# Altium schematic sheet Sheet2.SchDoc: solar-powered-remote-water-level-relay
size 419 x 297 mm; Date: 2026/06/29; Author: forlook88@gmail.com; Revision: 0; SheetNumber: 2; SheetTotal: 11
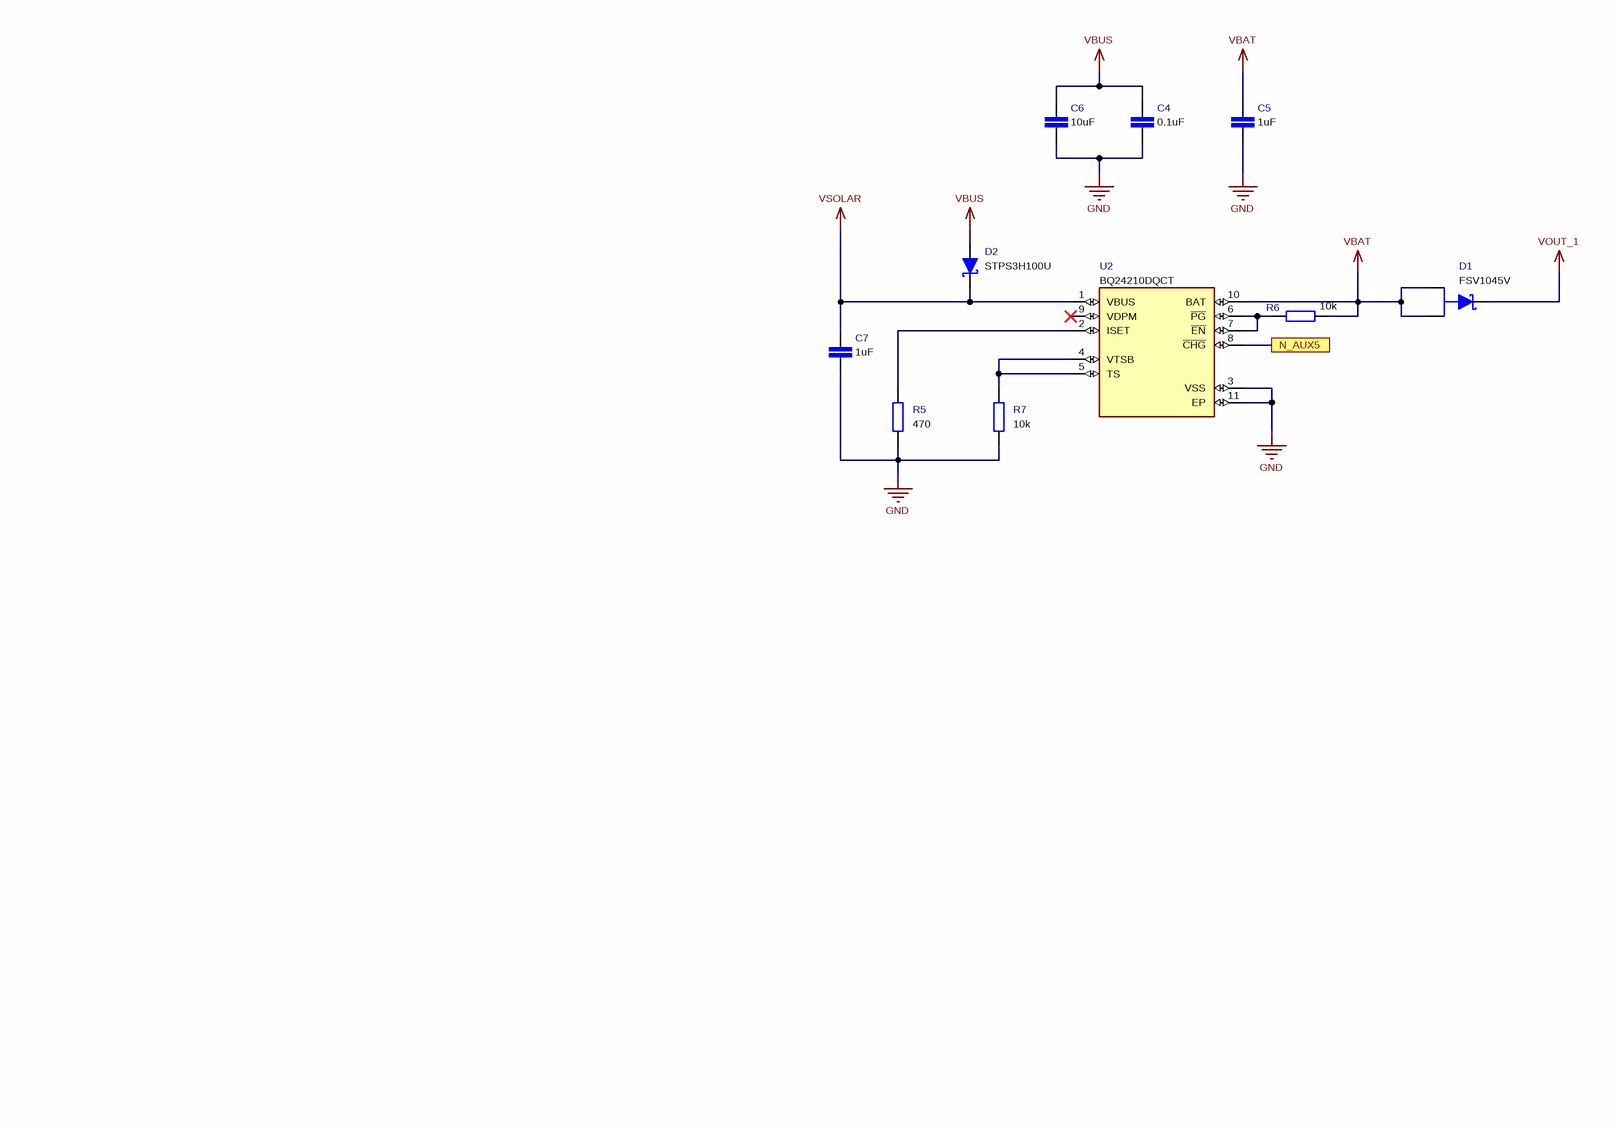
[diagram p0: Sheet2.SchDoc]

## Parts
C4  value 0.1uF
C5  value 1uF
C6  value 10uF
C7  value 1uF
D1  value FSV1045V
D2  value STPS3H100U
R5  value 470
R6  value 10k
R7  value 10k
U2  value BQ24210DQCT

## Ports
N_AUX5

## Nets
GND: C4.2 C5.2 C6.2 C7.2 R5.1 R7.1 U2.3(VSS) U2.11(EP)
VBAT: C5.1 D1.1(A) D1.2(A1) R6.1 U2.10(BAT)
VBUS: C4.1 C6.1 D2.1(A)
VOUT_1: D1.3(K)
VSOLAR: C7.1 D2.2(K) U2.1(VBUS)
N_AUX5: U2.8(~{CHG}) ; port N_AUX5
NetR5_2: R5.2 U2.2(ISET)
NetR6_2: R6.2 U2.6(~{PG}) U2.7(~{EN})
NetR7_2: R7.2 U2.4(VTSB) U2.5(TS)

Not connected (* = marked no-connect by the designer): U2 9(VDPM)*

## Notes on the sheet
- Document Name:
- Project Name:
- Sheet Name:
- Sheet Number:
- Author:
- CELUS Design Platform electronic designs are machine-generated drafts and require verification by qualified specialists.
- of
- Revision:
- Date:
- By using these designs, you agree to the CELUS Terms of Use: https://www.celus.io/terms-of-use

## Library data of the parts
C4 = (no symbol name): Manufacturer Part Number: CL05B104KO5NNNC; Manufacturer: Samsung
C5 C7 = (no symbol name): Manufacturer Part Number: CL05A105KO5NNNC; Manufacturer: Samsung Electro-Mechanics
C6 = (no symbol name): Manufacturer Part Number: CL31A106KAHNNNE; Manufacturer: Samsung
D1 = (no symbol name): Manufacturer: onsemi; Manufacturer Part Number: FSV1045V
D2 = (no symbol name): Manufacturer: STMicroelectronics; Manufacturer Part Number: STPS3H100U
R5 = (no symbol name): Manufacturer Part Number: RC0402FR-07470RL; Manufacturer: YAGEO
R6 R7 = (no symbol name): Manufacturer Part Number: RC1005F103CS; Manufacturer: Samsung
U2 = (no symbol name): Manufacturer: Texas Instruments; Manufacturer Part Number: BQ24210DQCT